# Altium schematic sheet Block Diagram.SchDoc
size 420 x 297 mm; SheetNumber: 2; SheetTotal: 3; ENG_APP_DATE: --/--/--; DSN_APP_DATE: --/--/--; CHK_APP_DATE: --/--/--; Dosya adı / File Name: BlockDiagram.SchDoc; Tanım / Description: Wireless Security Detector; Hazırlayan / Prepared By: MFY; Kontrol eden / Checked by: MFY; Onaylayan  /Approved by: MFY; Bölüm / Department: R&D - ARGE; Yayın Tarihi / Rel.date: 11.08.2025; Değ. tarihi / change date: 11.08.2025; Revizyon / Revision: AA; Size: A3
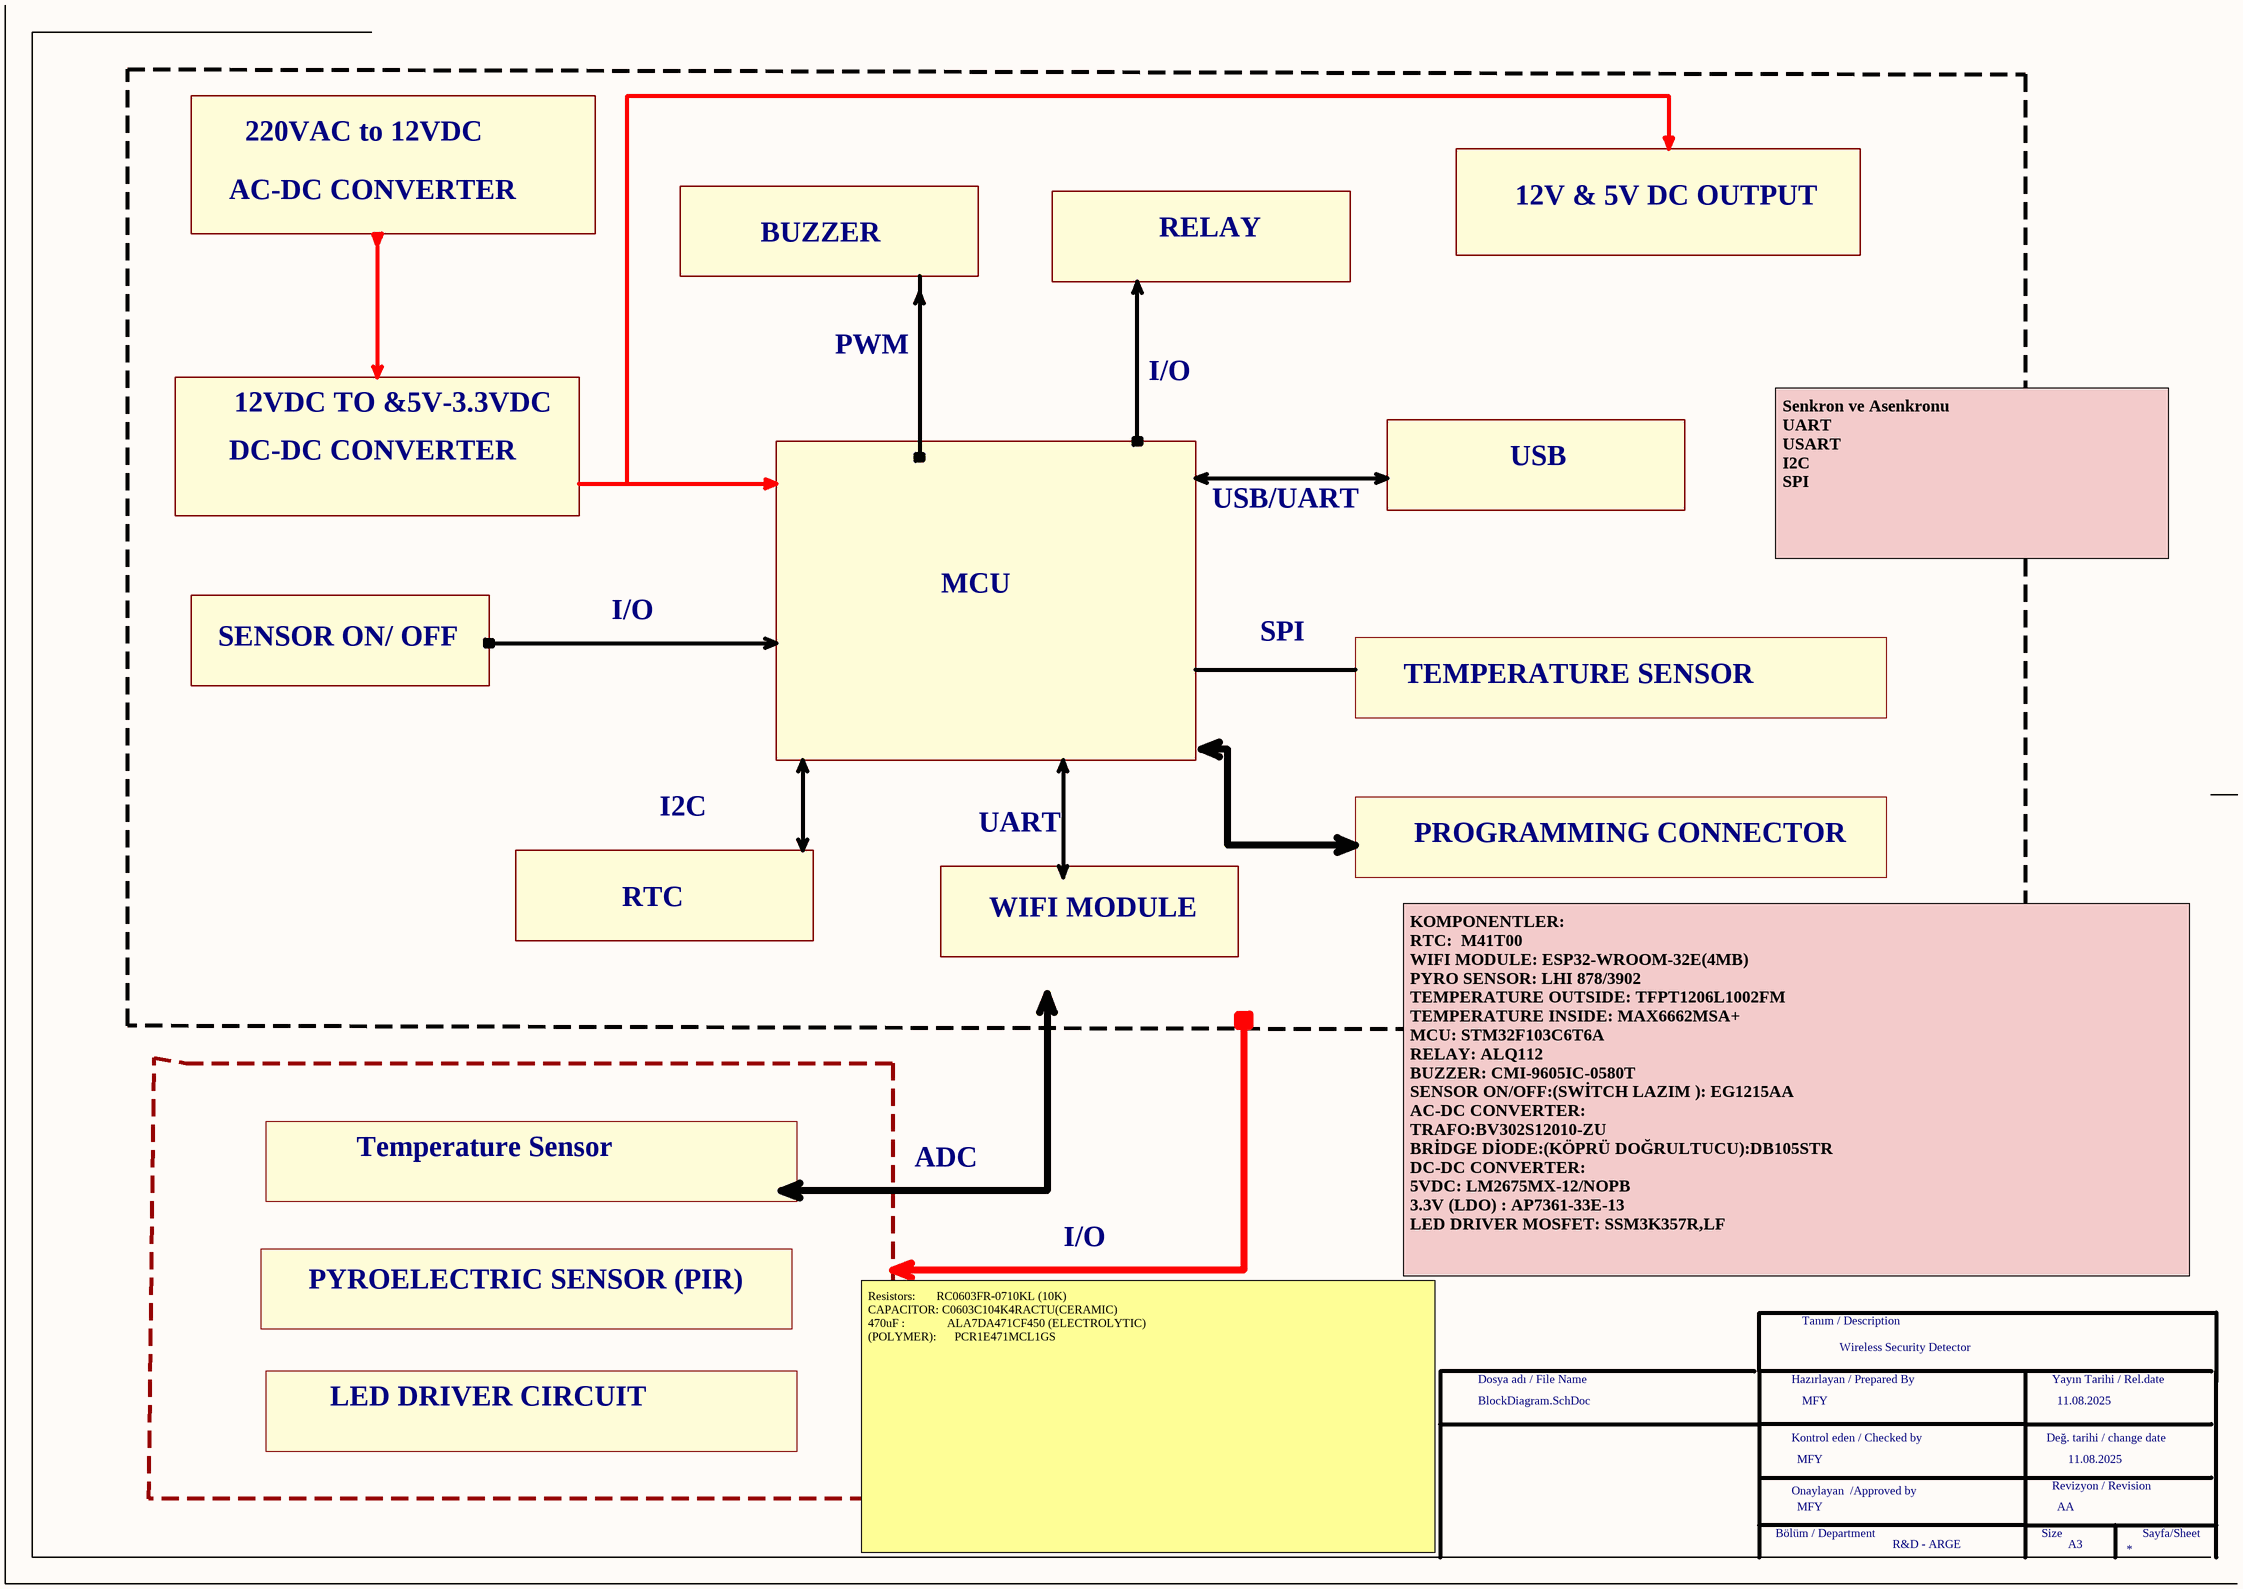
[diagram p0: Block Diagram.SchDoc]

## Notes on the sheet
- 220VAC to 12VDC
- AC-DC CONVERTER
- BUZZER
- RELAY
- 12V & 5V DC OUTPUT
- PWM
- I/O
- DC-DC CONVERTER
- 12VDC TO &5V-3.3VDC
- USB/UART
- USB
- MCU
- Senkron ve Asenkronu
  UART
  USART
  I2C
  SPI
- SENSOR ON/ OFF
- SPI
- TEMPERATURE SENSOR
- I2C
- UART
- PROGRAMMING CONNECTOR
- RTC
- WIFI MODULE
- Temperature Sensor
- ADC
- KOMPONENTLER:
  RTC:  M41T00
  WIFI MODULE: ESP32-WROOM-32E(4MB)
  PYRO SENSOR: LHI 878/3902
  TEMPERATURE OUTSIDE: TFPT1206L1002FM
  TEMPERATURE INSIDE: MAX6662MSA+
  MCU: STM32F103C6T6A
  RELAY: ALQ112
  BUZZER: CMI-9605IC-0580T
  SENSOR ON/OFF:(SWİTCH LAZIM ): EG1215AA
  AC-DC CONVERTER:
  TRAFO:BV302S12010-ZU
  BRİDGE DİODE:(KÖPRÜ DOĞRULTUCU):DB105STR
  DC-DC CONVERTER:
  5VDC: LM2675MX-12/NOPB
  3.3V (LDO) : AP7361-33E-13
  LED DRIVER MOSFET: SSM3K357R,LF
- PYROELECTRIC SENSOR (PIR)
- LED DRIVER CIRCUIT
- Resistors:       RC0603FR-0710KL (10K)
  CAPACITOR: C0603C104K4RACTU(CERAMIC)
  470uF :              ALA7DA471CF450 (ELECTROLYTIC)
  (POLYMER):      PCR1E471MCL1GS
- Tanım / Description
- Dosya adı / File Name
- Hazırlayan / Prepared By
- Yayın Tarihi / Rel.date
- Kontrol eden / Checked by
- Değ. tarihi / change date
- Bölüm / Department
- Onaylayan  /Approved by
- Size
- Revizyon / Revision
- Sayfa/Sheet